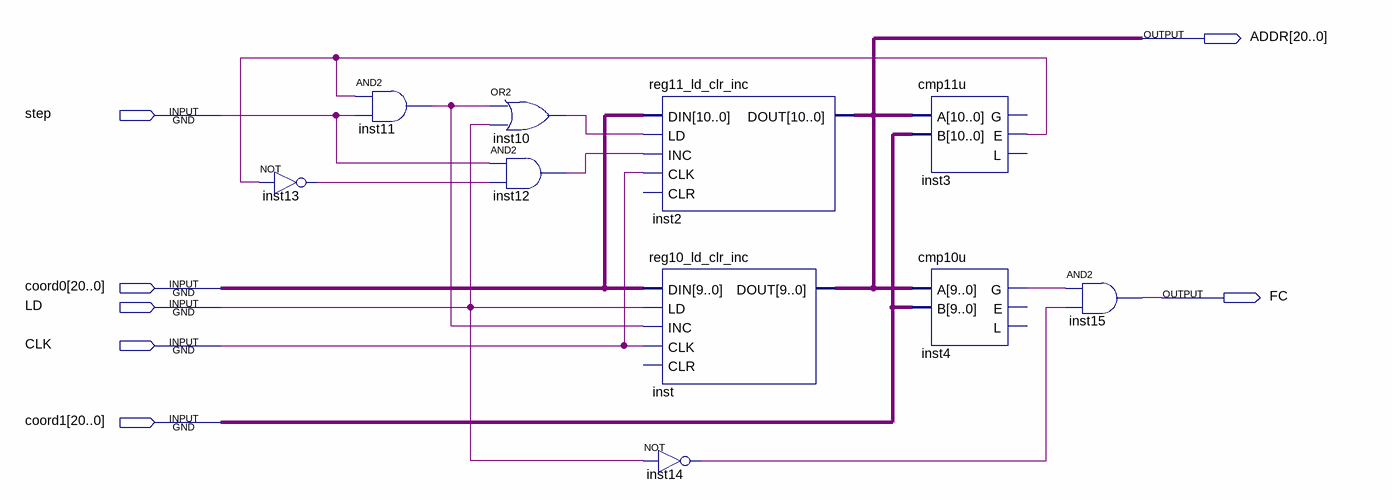
[diagram p0: schematic sheet]
// Quartus schematic gca_drct.bdf as structural Verilog: 10 symbols, 7 pins
module gca_drct (
  input  step,
  input  [20:0] coord0,
  input  LD,
  input  CLK,
  input  [20:0] coord1,
  output [20:0] ADDR,
  output FC
);

  wire inst3_e, inst4_g, inst10_out, inst11_out, inst12_out, inst13_out, inst14_out;

  not inst13 (inst13_out, inst3_e);
  and inst11 (inst11_out, inst3_e, step);
  or inst10 (inst10_out, inst11_out, LD);
  and inst12 (inst12_out, step, inst13_out);
  reg11_ld_clr_inc inst2 (
    .DIN(coord0[10:0]), .LD(inst10_out), .INC(inst12_out), .CLK(CLK), .DOUT(ADDR[10:0]));  // open: CLR
  reg10_ld_clr_inc inst (.DIN(coord0[20:11]), .LD(LD), .INC(inst11_out), .CLK(CLK), .DOUT(ADDR[20:11]));  // open: CLR
  not inst14 (inst14_out, LD);
  cmp11u inst3 (.A(ADDR[10:0]), .B(coord1[10:0]), .E(inst3_e));  // open: G, L
  cmp10u inst4 (.A(ADDR[20:11]), .B(coord1[20:11]), .G(inst4_g));  // open: E, L
  and inst15 (FC, inst4_g, inst14_out);

  // Other names for the same wires on the sheet: x0[10:0] = ADDR[10:0]; x1[10:0] = coord1[10:0];
  //   y0[9:0] = ADDR[20:11]; y1[9:0] = coord1[20:11]
endmodule
